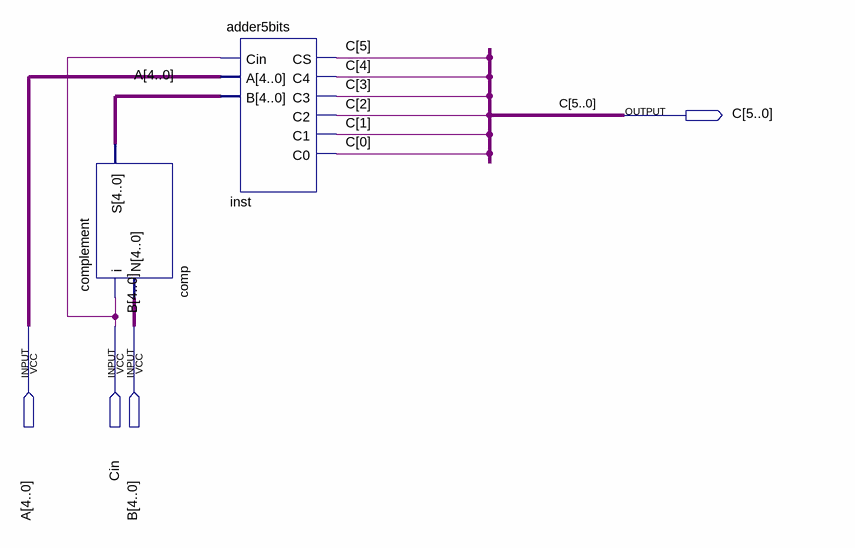
[diagram p0: schematic sheet]
// Quartus schematic Adder_Subtrator.bdf as structural Verilog: 2 symbols, 4 pins
module Adder_Subtrator (
  input  [4:0] A,
  input  Cin,
  input  [4:0] B,
  output [5:0] C
);

  wire [4:0] comp_s;

  complement comp (.i(Cin), .N(B), .S(comp_s));
  adder5bits inst (.Cin(Cin), .A(A), .B(comp_s), .CS(C[5]), .C4(C[4]), .C3(C[3]), .C2(C[2]), .C1(C[1]), .C0(C[0]));
endmodule
